# Altium schematic sheet Sheet_1.schdoc
size 253 x 175 mm
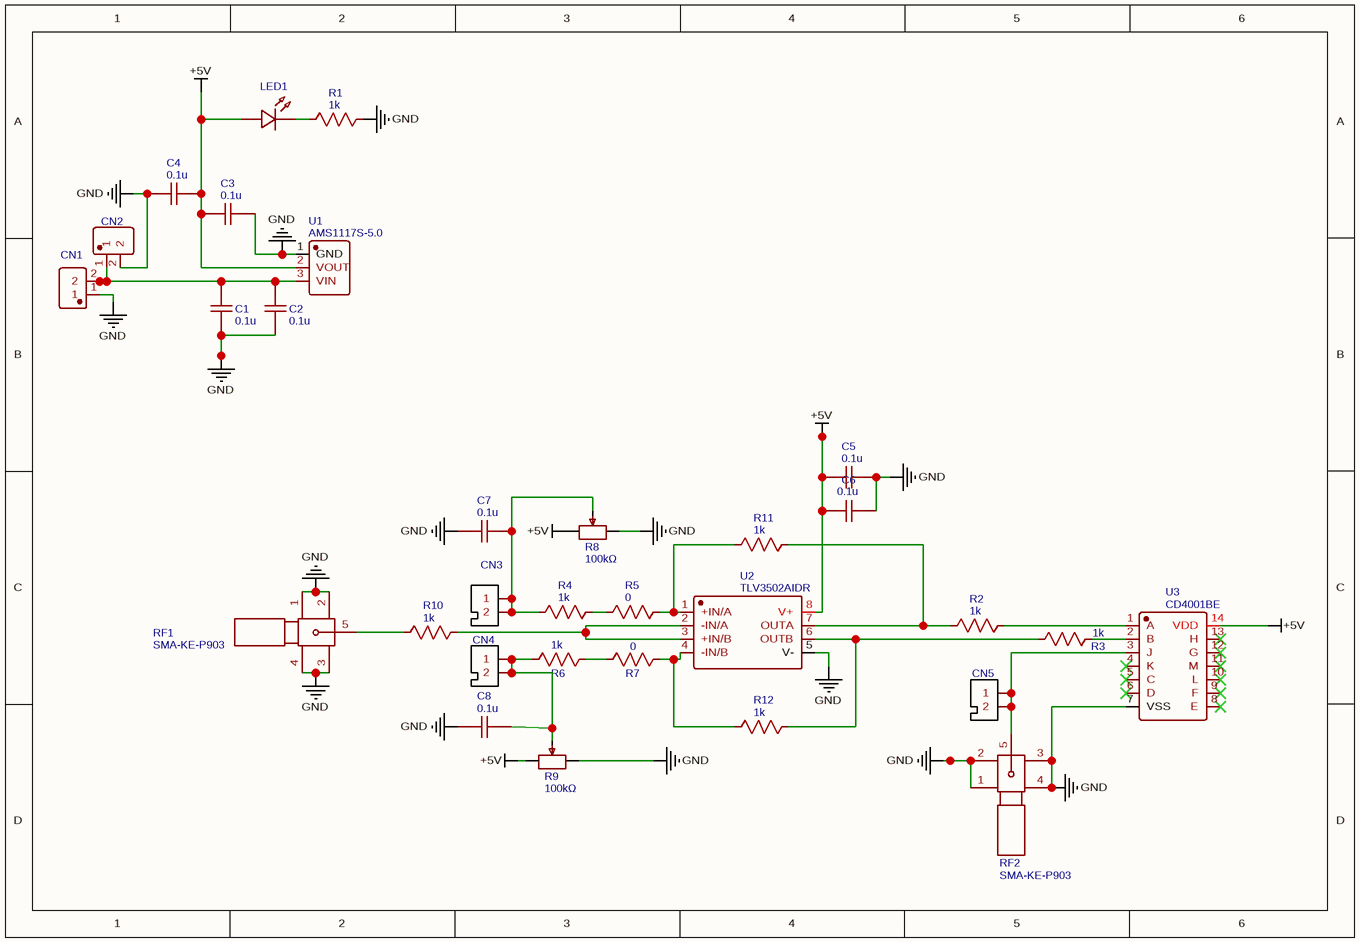
[diagram p0: Sheet_1.schdoc]

## Parts
C1  0.1u  [C0603]
C2  0.1u  [C0603]
C3  0.1u  [C0603]
C4  0.1u  [C0603]
C5  0.1u  [C0603]
C6  0.1u  [C0603]
C7  0.1u  [C0603]
C8  0.1u  [C0603]
CN1  VH-2A_C722829  [CONN-TH_VH-2A]  (value not drawn)
CN2  VH-2A_C722829  [CONN-TH_VH-2A]  (value not drawn)
CN3  A2543WV-2P  [CONN-TH_A2543WV-2P]  (value not drawn)
CN4  A2543WV-2P  [CONN-TH_A2543WV-2P]  (value not drawn)
CN5  A2543WV-2P  [CONN-TH_A2543WV-2P]  (value not drawn)
LED1  LED-0603_R  [LED0603_RED]  (value not drawn)
R1  1k  [R0603]
R2  1k  [R0603]
R3  1k  [R0603]
R4  1k  [R0603]
R5  0  [R0603]
R6  1k  [R0603]
R7  0  [R0603]
R8  100kΩ  [RES-ADJ-TH_3296W]
R9  100kΩ  [RES-ADJ-TH_3296W]
R10  1k  [R0603]
R11  1k  [R0603]
R12  1k  [R0603]
RF1  SMA-KE-P903  [SMA-TH_SMA-KE-P903]
RF2  SMA-KE-P903  [SMA-TH_SMA-KE-P903]
U1  AMS1117S-5.0  [SOT-89-3_L4.5-W2.5-P1.50-LS4.2-BR]
U2  TLV3502AIDR  [SOIC-8_L4.9-W3.9-P1.27-LS6.0-BL]
U3  CD4001BE  [PDIP-14_L19.3-W6.4-P2.54-LS7.6-BL]

## Nets
+5V: C3.1 C4.2 C5.1 C6.1 LED1.1 R8.3 R9.3 U1.2(VOUT) U2.8(V+) U3.14(VDD)
GND: C1.1 C2.1 C3.2 C4.1 C5.2 C6.2 C7.1 C8.1 CN1.1 CN2.2 R1.2 R8.1 R9.1 RF1.1 RF1.2 RF1.3 RF1.4 RF2.1 RF2.2 RF2.3 RF2.4 U1.1(GND) U2.5(V-) U3.7(VSS)
NetC1_2: C1.2 C2.2 CN1.2 CN2.1 U1.3(VIN)
NetC7_2: C7.2 CN3.1 CN3.2 R4.1 R8.2
NetC8_2: C8.2 CN4.1 CN4.2 R6.1 R9.2
NetCN5_1: CN5.1 CN5.2 RF2.5 U3.3(J)
NetLED1_2: LED1.2 R1.1
NetR2_1: R2.1 R11.2 U2.7(OUTA)
NetR2_2: R2.2 U3.1(A)
NetR3_1: R3.1 R12.2 U2.6(OUTB)
NetR3_2: R3.2 U3.2(B)
NetR4_2: R4.2 R5.1
NetR5_2: R5.2 R11.1 U2.1(+IN/A)
NetR6_2: R6.2 R7.1
NetR7_2: R7.2 R12.1 U2.4(-IN/B)
NetR10_1: R10.1 RF1.5
NetR10_2: R10.2 U2.2(-IN/A) U2.3(+IN/B)

Not connected (* = marked no-connect by the designer): U3 4(K)* 5(C)* 6(D)* 8(E)* 9(F)* 10(L)* 11(M)* 12(G)* 13(H)*

## Library data of the parts
C1-C8 = 0.1u: nameAlias: Value(F); Contributor: LCEDA_Lib; spicePre: C; spiceSymbolName: C_0603_US
CN1 CN2 = VH-2A_C722829: BOM_Manufacturer: CAX; BOM_Manufacturer Part: VH-2A; Contributor: LCSC; BOM_Supplier: LCSC; BOM_Supplier Part: C722829; BOM_JLCPCB Part Class: Extended Part; spicePre: C; spiceSymbolName: VH-2A_C722829
CN3-CN5 = A2543WV-2P: BOM_Manufacturer: Changjiang Connectors; Contributor: LCSC; BOM_Supplier: LCSC; BOM_Supplier Part: C239362; BOM_Manufacturer Part: A2543WV-2P; link: https://item.szlcsc.com/238466.html?ref=editor&logined=true; BOM_JLCPCB Part Class: Extended Part; spicePre: C; spiceSymbolName: A2543WV-2P
LED1 = LED-0603_R: BOM_Manufacturer: EVERLIGHT(台湾亿光); BOM_Manufacturer Part: 19-217/R6C-AL1M2VY/3T; Contributor: LCEDA_01; BOM_Supplier Part: C72044; BOM_Supplier: LCSC; spicePre: L; spiceSymbolName: LED-0603_R
R1-R4 R6 R10-R12 = 1k: nameAlias: Value(Ω); Contributor: LCEDA_Lib; spicePre: R; spiceSymbolName: R_0603_US
R5 R7 = 0: nameAlias: Value(Ω); Contributor: LCEDA_Lib; spicePre: R; spiceSymbolName: R_0603_US
R8 R9 = 100kΩ: BOM_Manufacturer: BOURNS; BOM_Manufacturer Part: 3296W-1-104LF; nameAlias: Resistance; Resistance(Ohms): 100K; BOM_Supplier: LCSC; BOM_Supplier Part: C48084; Resistance (Ohms): 100K; BOM_JLCPCB Part Class: Extended Part; spicePre: R; spiceSymbolName: 3296W-1-104LF
RF1 RF2 = SMA-KE-P903: BOM_Manufacturer: DreamLNK; Contributor: LCSC; BOM_Supplier: LCSC; BOM_Supplier Part: C914558; BOM_Manufacturer Part: SMA-KE-P903; spicePre: R; spiceSymbolName: SMA-KE-P903
U1 = AMS1117S-5.0: BOM_Manufacturer: JSMSEMI; subpart_no: 1; Contributor: LCSC; BOM_Supplier: LCSC; BOM_Supplier Part: C917182; BOM_Manufacturer Part: AMS1117S-5.0; BOM_JLCPCB Part Class: Extended Part; spicePre: U; spiceSymbolName: AMS1117S-5.0
U2 = TLV3502AIDR: BOM_Manufacturer: TI; Contributor: LCSC; BOM_Supplier: LCSC; BOM_Manufacturer Part: TLV3502AIDR; BOM_Supplier Part: C131165; BOM_JLCPCB Part Class: Extended Part; spicePre: U; spiceSymbolName: TLV3502AIDR
U3 = CD4001BE: BOM_Manufacturer: TI; spicePre: X; BOM_Supplier: LCSC; BOM_Manufacturer Part: CD4001BE; BOM_Supplier Part: C5225; BOM_JLCPCB Part Class: Extended Part; spiceSymbolName: CD4001BE